# Altium schematic sheet M-LVDS PHY.SchDoc
size A4; DocumentNumber: 22; SheetNumber: 22; SheetTotal: 30
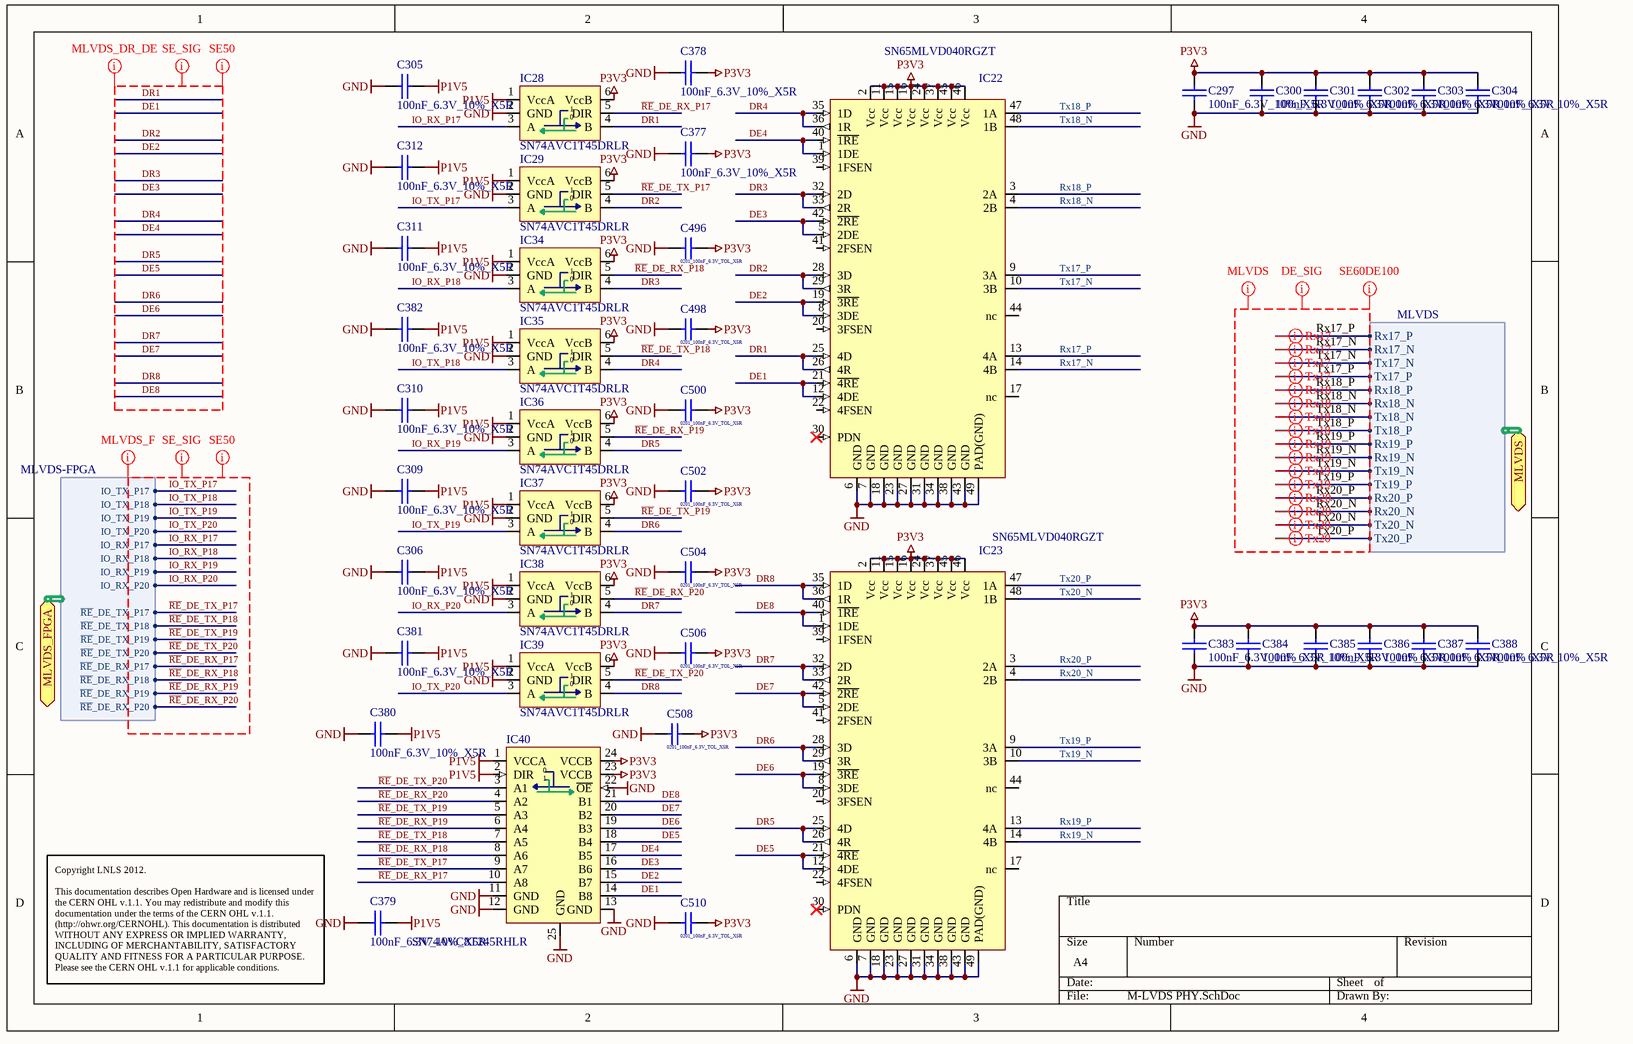
[diagram p0: M-LVDS PHY.SchDoc]

## Parts
C297  100nF_6.3V_10%_X5R  [0201C]
C300  100nF_6.3V_10%_X5R  [0201C]
C301  100nF_6.3V_10%_X5R  [0201C]
C302  100nF_6.3V_10%_X5R  [0201C]
C303  100nF_6.3V_10%_X5R  [0201C]
C304  100nF_6.3V_10%_X5R  [0201C]
C305  100nF_6.3V_10%_X5R  [0201C]
C306  100nF_6.3V_10%_X5R  [0201C]
C309  100nF_6.3V_10%_X5R  [0201C]
C310  100nF_6.3V_10%_X5R  [0201C]
C311  100nF_6.3V_10%_X5R  [0201C]
C312  100nF_6.3V_10%_X5R  [0201C]
C377  100nF_6.3V_10%_X5R  [0201C]
C378  100nF_6.3V_10%_X5R  [0201C]
C379  100nF_6.3V_10%_X5R  [0201C]
C380  100nF_6.3V_10%_X5R  [0201C]
C381  100nF_6.3V_10%_X5R  [0201C]
C382  100nF_6.3V_10%_X5R  [0201C]
C383  100nF_6.3V_10%_X5R  [0201C]
C384  100nF_6.3V_10%_X5R  [0201C]
C385  100nF_6.3V_10%_X5R  [0201C]
C386  100nF_6.3V_10%_X5R  [0201C]
C387  100nF_6.3V_10%_X5R  [0201C]
C388  100nF_6.3V_10%_X5R  [0201C]
C496  0201_100nF_6.3V_TOL_X5R  [CAPC0603X33N]
C498  0201_100nF_6.3V_TOL_X5R  [CAPC0603X33N]
C500  0201_100nF_6.3V_TOL_X5R  [CAPC0603X33N]
C502  0201_100nF_6.3V_TOL_X5R  [CAPC0603X33N]
C504  0201_100nF_6.3V_TOL_X5R  [CAPC0603X33N]
C506  0201_100nF_6.3V_TOL_X5R  [CAPC0603X33N]
C508  0201_100nF_6.3V_TOL_X5R  [CAPC0603X33N]
C510  0201_100nF_6.3V_TOL_X5R  [CAPC0603X33N]
IC22  SN65MLVD040RGZT  [QFN48L]
IC23  SN65MLVD040RGZT  [QFN48L]
IC28  SN74AVC1T45DRLR  [SOT-553]
IC29  SN74AVC1T45DRLR  [SOT-553]
IC34  SN74AVC1T45DRLR  [SOT-553]
IC35  SN74AVC1T45DRLR  [SOT-553]
IC36  SN74AVC1T45DRLR  [SOT-553]
IC37  SN74AVC1T45DRLR  [SOT-553]
IC38  SN74AVC1T45DRLR  [SOT-553]
IC39  SN74AVC1T45DRLR  [SOT-553]
IC40  SN74AVC8T245RHLR  [QFN50P350X550X100-24N]

## Ports
MLVDS (harness MLVDS), MLVDS_FPGA (harness MLVDS-FPGA)

## Harnesses
MLVDS: Rx17_P, Rx17_N, Tx17_N, Tx17_P, Rx18_P, Rx18_N, Tx18_N, Tx18_P, Rx19_P, Rx19_N, Tx19_N, Tx19_P, Rx20_P, Rx20_N, Tx20_N, Tx20_P
MLVDS-FPGA: IO_TX_P17, IO_TX_P18, IO_TX_P19, IO_TX_P20, IO_RX_P17, IO_RX_P18, IO_RX_P19, IO_RX_P20, ~{RE}_DE_TX_P17, ~{RE}_DE_TX_P18, ~{RE}_DE_TX_P19, ~{RE}_DE_TX_P20, ~{RE}_DE_RX_P17, ~{RE}_DE_RX_P18, ~{RE}_DE_RX_P19, ~{RE}_DE_RX_P20

## Nets
GND: C297.2 C300.2 C301.2 C302.2 C303.2 C304.2 C305.2 C306.1 C309.1 C310.1 C311.1 C312.1 C377.1 C378.1 C379.1 C380.1 C381.1 C382.1 C383.2 C384.2 C385.2 C386.2 C387.2 C388.2 C496.2 C498.2 C500.2 C502.2 C504.2 C506.2 C508.2 C510.2 IC22.6(GND) IC22.7(GND) IC22.18(GND) IC22.23(GND) IC22.27(GND) IC22.31(GND) IC22.34(GND) IC22.38(GND) IC22.43(GND) IC22.49(PAD(GND)) IC23.6(GND) IC23.7(GND) IC23.18(GND) IC23.23(GND) IC23.27(GND) IC23.31(GND) IC23.34(GND) IC23.38(GND) IC23.43(GND) IC23.49(PAD(GND)) IC28.2(GND) IC29.2(GND) IC34.2(GND) IC35.2(GND) IC36.2(GND) IC37.2(GND) IC38.2(GND) IC39.2(GND) IC40.11(GND) IC40.12(GND) IC40.13(GND) IC40.22(~{OE}) IC40.25(GND)
P1V5: C305.1 C306.2 C309.2 C310.2 C311.2 C312.2 C379.2 C380.2 C381.2 C382.2 IC28.1(VccA) IC29.1(VccA) IC34.1(VccA) IC35.1(VccA) IC36.1(VccA) IC37.1(VccA) IC38.1(VccA) IC39.1(VccA) IC40.1(VCCA) IC40.2(DIR)
P3V3: C297.1 C300.1 C301.1 C302.1 C303.1 C304.1 C377.2 C378.2 C383.1 C384.1 C385.1 C386.1 C387.1 C388.1 C496.1 C498.1 C500.1 C502.1 C504.1 C506.1 C508.1 C510.1 IC22.2(Vcc) IC22.11(Vcc) IC22.15(Vcc) IC22.16(Vcc) IC22.24(Vcc) IC22.37(Vcc) IC22.45(Vcc) IC22.46(Vcc) IC23.2(Vcc) IC23.11(Vcc) IC23.15(Vcc) IC23.16(Vcc) IC23.24(Vcc) IC23.37(Vcc) IC23.45(Vcc) IC23.46(Vcc) IC28.6(VccB) IC29.6(VccB) IC34.6(VccB) IC35.6(VccB) IC36.6(VccB) IC37.6(VccB) IC38.6(VccB) IC39.6(VccB) IC40.23(VCCB) IC40.24(VCCB)
DE1: IC22.12(4DE) IC22.21(~{4RE}) IC40.14(B8)
DE2: IC22.8(3DE) IC22.19(~{3RE}) IC40.15(B7)
DE3: IC22.5(2DE) IC22.42(~{2RE}) IC40.16(B6)
DE4: IC22.1(1DE) IC22.40(~{1RE}) IC40.17(B5)
DE5: IC23.12(4DE) IC23.21(~{4RE}) IC40.18(B4)
DE6: IC23.8(3DE) IC23.19(~{3RE}) IC40.19(B3)
DE7: IC23.5(2DE) IC23.42(~{2RE}) IC40.20(B2)
DE8: IC23.1(1DE) IC23.40(~{1RE}) IC40.21(B1)
DR1: IC22.25(4D) IC22.26(4R) IC28.4(B)
DR2: IC22.28(3D) IC22.29(3R) IC29.4(B)
DR3: IC22.32(2D) IC22.33(2R) IC34.4(B)
DR4: IC22.35(1D) IC22.36(1R) IC35.4(B)
DR5: IC23.25(4D) IC23.26(4R) IC36.4(B)
DR6: IC23.28(3D) IC23.29(3R) IC37.4(B)
DR7: IC23.32(2D) IC23.33(2R) IC38.4(B)
DR8: IC23.35(1D) IC23.36(1R) IC39.4(B)
IO_RX_P17: IC28.3(A) ; port MLVDS_FPGA.IO_RX_P17
IO_RX_P18: IC34.3(A) ; port MLVDS_FPGA.IO_RX_P18
IO_RX_P19: IC36.3(A) ; port MLVDS_FPGA.IO_RX_P19
IO_RX_P20: IC38.3(A) ; port MLVDS_FPGA.IO_RX_P20
IO_TX_P17: IC29.3(A) ; port MLVDS_FPGA.IO_TX_P17
IO_TX_P18: IC35.3(A) ; port MLVDS_FPGA.IO_TX_P18
IO_TX_P19: IC37.3(A) ; port MLVDS_FPGA.IO_TX_P19
IO_TX_P20: IC39.3(A) ; port MLVDS_FPGA.IO_TX_P20
~{RE}_DE_RX_P17: IC28.5(DIR) IC40.10(A8) ; port MLVDS_FPGA.~{RE}_DE_RX_P17
~{RE}_DE_RX_P18: IC34.5(DIR) IC40.8(A6) ; port MLVDS_FPGA.~{RE}_DE_RX_P18
~{RE}_DE_RX_P19: IC36.5(DIR) IC40.6(A4) ; port MLVDS_FPGA.~{RE}_DE_RX_P19
~{RE}_DE_RX_P20: IC38.5(DIR) IC40.4(A2) ; port MLVDS_FPGA.~{RE}_DE_RX_P20
~{RE}_DE_TX_P17: IC29.5(DIR) IC40.9(A7) ; port MLVDS_FPGA.~{RE}_DE_TX_P17
~{RE}_DE_TX_P18: IC35.5(DIR) IC40.7(A5) ; port MLVDS_FPGA.~{RE}_DE_TX_P18
~{RE}_DE_TX_P19: IC37.5(DIR) IC40.5(A3) ; port MLVDS_FPGA.~{RE}_DE_TX_P19
~{RE}_DE_TX_P20: IC39.5(DIR) IC40.3(A1) ; port MLVDS_FPGA.~{RE}_DE_TX_P20
Rx17_N: IC22.14(4B) ; port MLVDS.Rx17_N
Rx17_P: IC22.13(4A) ; port MLVDS.Rx17_P
Rx18_N: IC22.4(2B) ; port MLVDS.Rx18_N
Rx18_P: IC22.3(2A) ; port MLVDS.Rx18_P
Rx19_N: IC23.14(4B) ; port MLVDS.Rx19_N
Rx19_P: IC23.13(4A) ; port MLVDS.Rx19_P
Rx20_N: IC23.4(2B) ; port MLVDS.Rx20_N
Rx20_P: IC23.3(2A) ; port MLVDS.Rx20_P
Tx17_N: IC22.10(3B) ; port MLVDS.Tx17_N
Tx17_P: IC22.9(3A) ; port MLVDS.Tx17_P
Tx18_N: IC22.48(1B) ; port MLVDS.Tx18_N
Tx18_P: IC22.47(1A) ; port MLVDS.Tx18_P
Tx19_N: IC23.10(3B) ; port MLVDS.Tx19_N
Tx19_P: IC23.9(3A) ; port MLVDS.Tx19_P
Tx20_N: IC23.48(1B) ; port MLVDS.Tx20_N
Tx20_P: IC23.47(1A) ; port MLVDS.Tx20_P

Not connected (* = marked no-connect by the designer): IC22 17(nc) 20(3FSEN) 22(4FSEN) 30(PDN)* 39(1FSEN) 41(2FSEN) 44(nc); IC23 17(nc) 20(3FSEN) 22(4FSEN) 30(PDN)* 39(1FSEN) 41(2FSEN) 44(nc)

## Layout directives
differential pair: Rx17_N, Rx17_P, Rx18_N, Rx18_P, Rx19_N, Rx19_P, Rx20_N, Rx20_P, Tx17_N, Tx17_P, Tx18_N, Tx18_P, Tx19_N, Tx19_P, Tx20_N, Tx20_P
net class MLVDS: Rx17_N, Rx17_P, Rx18_N, Rx18_P, Rx19_N, Rx19_P, Rx20_N, Rx20_P, Tx17_N, Tx17_P, Tx18_N, Tx18_P, Tx19_N, Tx19_P, Tx20_N, Tx20_P
net class DE_SIG: Rx17_N, Rx17_P, Rx18_N, Rx18_P, Rx19_N, Rx19_P, Rx20_N, Rx20_P, Tx17_N, Tx17_P, Tx18_N, Tx18_P, Tx19_N, Tx19_P, Tx20_N, Tx20_P
net class SE60DE100: Rx17_N, Rx17_P, Rx18_N, Rx18_P, Rx19_N, Rx19_P, Rx20_N, Rx20_P, Tx17_N, Tx17_P, Tx18_N, Tx18_P, Tx19_N, Tx19_P, Tx20_N, Tx20_P
net class MLVDS_F: IO_RX_P17, IO_RX_P18, IO_RX_P19, IO_RX_P20, IO_TX_P17, IO_TX_P18, IO_TX_P19, IO_TX_P20, ~{RE}_DE_RX_P17, ~{RE}_DE_RX_P18, ~{RE}_DE_RX_P19, ~{RE}_DE_RX_P20, ~{RE}_DE_TX_P17, ~{RE}_DE_TX_P18, ~{RE}_DE_TX_P19, ~{RE}_DE_TX_P20
net class SE50: DE1, DE2, DE3, DE4, DE5, DE6, DE7, DE8, DR1, DR2, DR3, DR4, DR5, DR6, DR7, DR8, IO_RX_P17, IO_RX_P18, IO_RX_P19, IO_RX_P20, IO_TX_P17, IO_TX_P18, IO_TX_P19, IO_TX_P20, ~{RE}_DE_RX_P17, ~{RE}_DE_RX_P18, ~{RE}_DE_RX_P19, ~{RE}_DE_RX_P20, ~{RE}_DE_TX_P17, ~{RE}_DE_TX_P18, ~{RE}_DE_TX_P19, ~{RE}_DE_TX_P20
net class SE_SIG: DE1, DE2, DE3, DE4, DE5, DE6, DE7, DE8, DR1, DR2, DR3, DR4, DR5, DR6, DR7, DR8, IO_RX_P17, IO_RX_P18, IO_RX_P19, IO_RX_P20, IO_TX_P17, IO_TX_P18, IO_TX_P19, IO_TX_P20, ~{RE}_DE_RX_P17, ~{RE}_DE_RX_P18, ~{RE}_DE_RX_P19, ~{RE}_DE_RX_P20, ~{RE}_DE_TX_P17, ~{RE}_DE_TX_P18, ~{RE}_DE_TX_P19, ~{RE}_DE_TX_P20
net class MLVDS_DR_DE: DE1, DE2, DE3, DE4, DE5, DE6, DE7, DE8, DR1, DR2, DR3, DR4, DR5, DR6, DR7, DR8

## Notes on the sheet
- Copyright LNLS 2012.
  This documentation describes Open Hardware and is licensed under the CERN OHL v.1.1. You may redistribute and modify this documentation under the terms of the CERN OHL v.1.1. (http://ohwr.org/CERNOHL). This documentation is distributed WITHOUT ANY EXPRESS OR IMPLIED WARRANTY, INCLUDING OF MERCHANTABILITY, SATISFACTORY QUALITY AND FITNESS FOR A PARTICULAR PURPOSE. Please see the CERN OHL v.1.1 for applicable conditions.
- (in symbol 74AVC1T45) 0
- (in symbol 74AVC8T245_QFN) 0

## Library data of the parts
C297 C300-C306 C309-C312 C377-C388 = CAP_SMD_0201: Capacitor SMD
C496 C498 C500 C502 C504 C506 C508 C510 = Ceramic_0201: MiscInfo: Biggest Cern Footprint [max height]; Document Name: M-LVDS PHY.SchDoc; Part Number: Ceramic_0201; FootprintSizeX (mm): 1.5; FootprintSizeY (mm): 0.7; FootprintRectangleArea (mm): 1.05; Thickness (Max) (mm): 0.33; FootprintAlias: 0201
IC22 IC23 = IFC_SN65MLVD040
IC28 IC29 IC34-IC39 = 74AVC1T45: 1-bit Transceiver Dual Supply (1.4...3.6V)
IC40 = 74AVC8T245_QFN: 8 channel bidir translator buffer (1.4..3.6V)